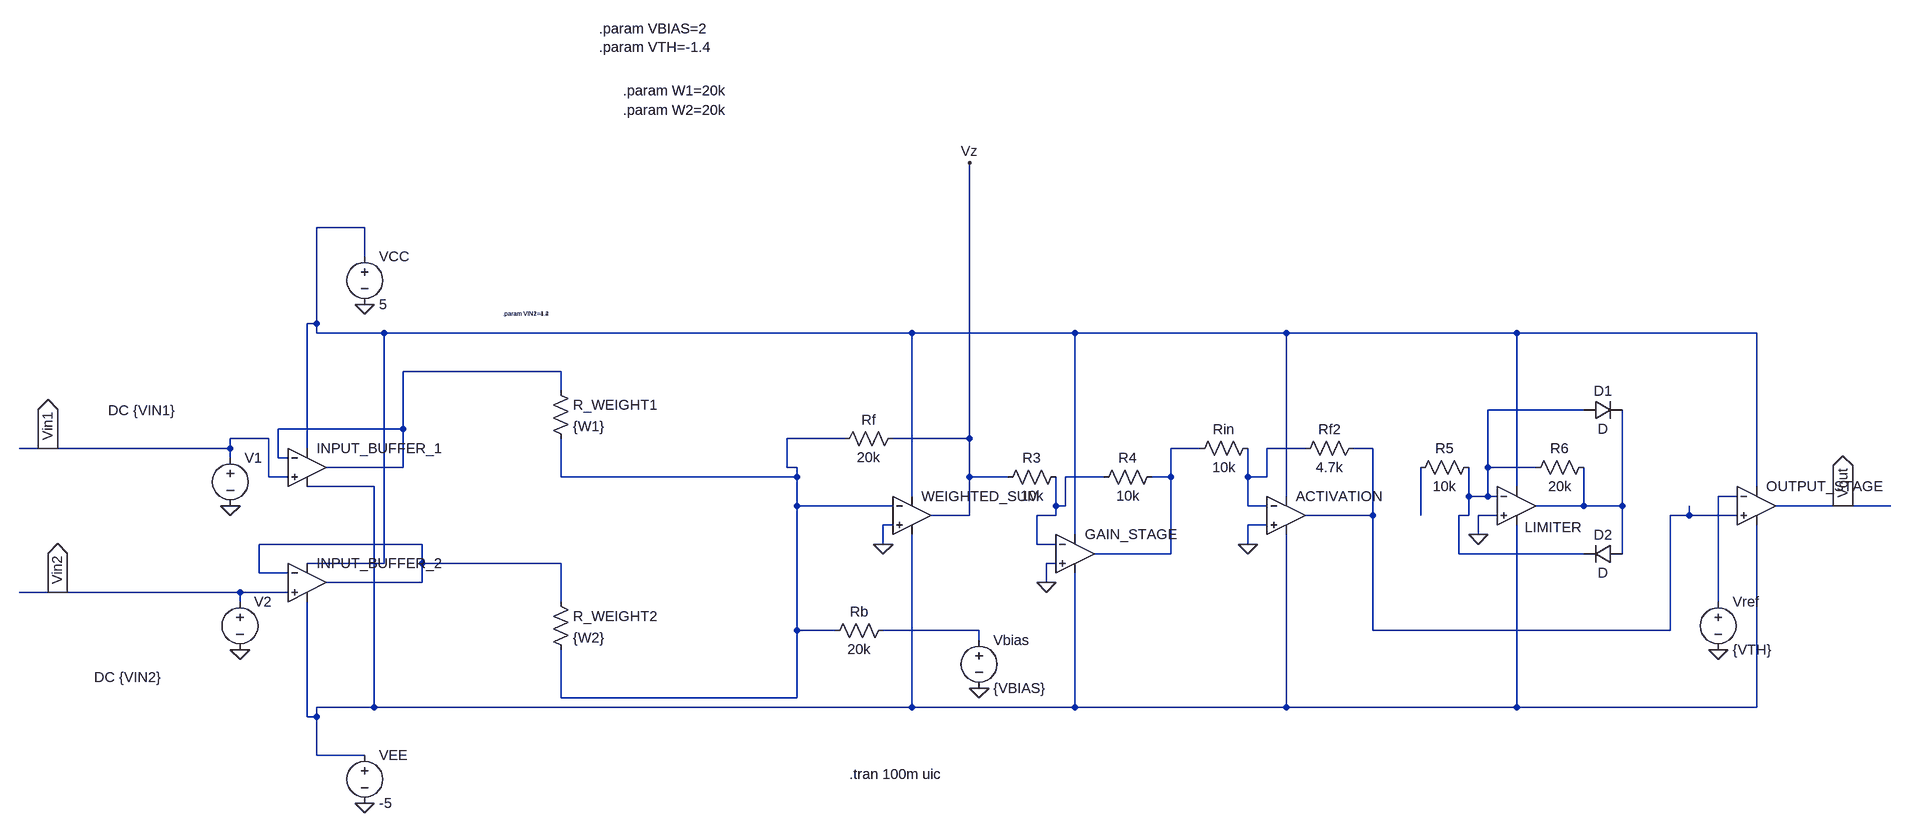
[diagram p0: schematic sim_00179.asc]
sim_00179.asc, the LTspice schematic file:
Version 4
SHEET 1 3976 980
WIRE -448 -112 -528 -112
WIRE -448 -64 -448 -112
WIRE -528 48 -528 -112
WIRE -528 48 -544 48
WIRE -528 64 -528 48
WIRE -416 64 -528 64
WIRE 816 64 -416 64
WIRE 1088 64 816 64
WIRE 1440 64 1088 64
WIRE 1824 64 1440 64
WIRE 2224 64 1824 64
WIRE 64 128 -384 128
WIRE 64 160 64 128
WIRE 1936 192 1776 192
WIRE -384 224 -384 128
WIRE -384 224 -592 224
WIRE -608 240 -672 240
WIRE 704 240 608 240
WIRE 912 240 912 -240
WIRE 912 240 784 240
WIRE -976 256 -1024 256
WIRE -672 256 -672 240
WIRE -672 256 -976 256
WIRE -544 256 -544 48
WIRE 1296 256 1248 256
WIRE 1472 256 1408 256
WIRE 1584 256 1552 256
WIRE -672 272 -672 256
WIRE -592 272 -592 224
WIRE -576 272 -592 272
WIRE -384 288 -384 224
WIRE -384 288 -512 288
WIRE 608 288 608 240
WIRE 624 288 608 288
WIRE 1776 288 1776 192
WIRE 1856 288 1776 288
WIRE -608 304 -608 240
WIRE -576 304 -608 304
WIRE 64 304 64 240
WIRE 624 304 624 288
WIRE 624 304 64 304
WIRE 912 304 912 240
WIRE 976 304 912 304
WIRE 1136 304 1072 304
WIRE 1248 304 1248 256
WIRE 1248 304 1216 304
WIRE 1376 304 1376 256
WIRE 1408 304 1408 256
WIRE 1408 304 1376 304
WIRE -432 320 -544 320
WIRE 1824 320 1824 64
WIRE 2224 320 2224 64
WIRE 816 336 816 64
WIRE 1440 336 1440 64
WIRE 1744 336 1744 288
WIRE 1776 336 1776 288
WIRE 1776 336 1744 336
WIRE 1792 336 1776 336
WIRE 2192 336 2160 336
WIRE 624 352 624 304
WIRE 784 352 624 352
WIRE 1056 352 1056 304
WIRE 1072 352 1072 304
WIRE 1072 352 1056 352
WIRE 1376 352 1376 304
WIRE 1408 352 1376 352
WIRE 1936 352 1936 288
WIRE 1936 352 1856 352
WIRE 2000 352 2000 192
WIRE 2000 352 1936 352
WIRE 2368 352 2256 352
WIRE 2448 352 2368 352
WIRE 912 368 912 304
WIRE 912 368 848 368
WIRE 1056 368 1056 352
WIRE 1056 368 1024 368
WIRE 1584 368 1584 256
WIRE 1584 368 1472 368
WIRE 1664 368 1664 288
WIRE 1744 368 1744 336
WIRE 1744 368 1728 368
WIRE 1792 368 1760 368
WIRE 2112 368 2112 352
WIRE 2112 368 2080 368
WIRE 2192 368 2112 368
WIRE 784 384 768 384
WIRE 1408 384 1376 384
WIRE 1088 400 1088 64
WIRE 1760 400 1760 368
WIRE -352 416 -624 416
WIRE 768 416 768 384
WIRE 1024 416 1024 368
WIRE 1056 416 1024 416
WIRE 1376 416 1376 384
WIRE 1248 432 1248 304
WIRE 1248 432 1120 432
WIRE 1728 432 1728 368
WIRE 1936 432 1728 432
WIRE 2000 432 2000 352
WIRE -416 448 -416 64
WIRE -416 448 -544 448
WIRE -352 448 -352 416
WIRE 64 448 -352 448
WIRE 1056 448 1040 448
WIRE -624 464 -624 416
WIRE -576 464 -624 464
WIRE -352 480 -352 448
WIRE -352 480 -512 480
WIRE 1040 480 1040 448
WIRE -960 496 -1024 496
WIRE -656 496 -960 496
WIRE -576 496 -656 496
WIRE -656 512 -656 496
WIRE 64 512 64 448
WIRE 2160 512 2160 336
WIRE 624 560 624 352
WIRE 688 560 624 560
WIRE 928 560 768 560
WIRE 1584 560 1584 368
WIRE 2080 560 2080 368
WIRE 2080 560 1584 560
WIRE 928 576 928 560
WIRE 64 672 64 592
WIRE 624 672 624 560
WIRE 624 672 64 672
WIRE -432 688 -432 320
WIRE -432 688 -528 688
WIRE 816 688 816 400
WIRE 816 688 -432 688
WIRE 1088 688 1088 464
WIRE 1088 688 816 688
WIRE 1440 688 1440 400
WIRE 1440 688 1088 688
WIRE 1824 688 1824 384
WIRE 1824 688 1440 688
WIRE 2224 688 2224 384
WIRE 2224 688 1824 688
WIRE -544 704 -544 512
WIRE -528 704 -528 688
WIRE -528 704 -544 704
WIRE -528 768 -528 704
WIRE -448 768 -528 768
FLAG -448 16 0
FLAG -448 848 0
FLAG -656 592 0
FLAG -672 352 0
FLAG 768 416 0
FLAG 928 656 0
FLAG 1040 480 0
FLAG -976 256 Vin1
IOPIN -976 256 Out
FLAG -960 496 Vin2
IOPIN -960 496 Out
FLAG 912 -240 Vz
FLAG 1376 416 0
FLAG 1760 400 0
FLAG 2160 592 0
FLAG 2368 352 Vout
IOPIN 2368 352 Out
SYMBOL voltage -448 -80 R0
WINDOW 123 0 0 Left 0
WINDOW 39 0 0 Left 0
SYMATTR InstName VCC
SYMATTR Value 5
SYMBOL voltage -448 752 R0
WINDOW 123 0 0 Left 0
WINDOW 39 0 0 Left 0
SYMATTR InstName VEE
SYMATTR Value -5
SYMBOL voltage -672 256 R0
WINDOW 3 -204 -63 Left 2
WINDOW 123 0 0 Left 0
WINDOW 39 0 0 Left 0
SYMATTR Value DC {VIN1}
SYMATTR InstName V1
SYMBOL voltage -656 496 R0
WINDOW 3 -243 142 Left 2
WINDOW 123 0 0 Left 0
WINDOW 39 0 0 Left 0
SYMATTR Value DC {VIN2}
SYMATTR InstName V2
SYMBOL OpAmps\\UniversalOpAmp2 -544 288 R0
SYMATTR InstName INPUT_BUFFER_1
SYMBOL OpAmps\\UniversalOpAmp2 -544 480 R0
SYMATTR InstName INPUT_BUFFER_2
SYMBOL OpAmps\\UniversalOpAmp2 816 368 R0
SYMATTR InstName WEIGHTED_SUM
SYMBOL res 800 224 R90
WINDOW 0 0 56 VBottom 2
WINDOW 3 32 56 VTop 2
SYMATTR InstName Rf
SYMATTR Value 20k
SYMBOL voltage 928 560 R0
WINDOW 123 0 0 Left 0
WINDOW 39 0 0 Left 0
SYMATTR InstName Vbias
SYMATTR Value {VBIAS}
SYMBOL res 784 544 R90
WINDOW 0 0 56 VBottom 2
WINDOW 3 32 56 VTop 2
SYMATTR InstName Rb
SYMATTR Value 20k
SYMBOL OpAmps\\UniversalOpAmp2 1088 432 R0
SYMATTR InstName GAIN_STAGE
SYMBOL res 1072 288 R90
WINDOW 0 0 56 VBottom 2
WINDOW 3 32 56 VTop 2
SYMATTR InstName R3
SYMATTR Value 10k
SYMBOL res 1232 288 R90
WINDOW 0 0 56 VBottom 2
WINDOW 3 32 56 VTop 2
SYMATTR InstName R4
SYMATTR Value 10k
SYMBOL OpAmps\\UniversalOpAmp2 1440 368 R0
SYMATTR InstName ACTIVATION
SYMBOL res 1392 240 R90
WINDOW 0 0 56 VBottom 2
WINDOW 3 32 56 VTop 2
SYMATTR InstName Rin
SYMATTR Value 10k
SYMBOL res 1568 240 R90
WINDOW 0 0 56 VBottom 2
WINDOW 3 32 56 VTop 2
SYMATTR InstName Rf2
SYMATTR Value 4.7k
SYMBOL OpAmps\\UniversalOpAmp2 1824 352 R0
WINDOW 0 14 36 Left 2
SYMATTR InstName LIMITER
SYMBOL diode 1936 208 R270
WINDOW 0 32 32 VTop 2
WINDOW 3 0 32 VBottom 2
SYMATTR InstName D1
SYMBOL diode 2000 416 R90
WINDOW 0 0 32 VBottom 2
WINDOW 3 32 32 VTop 2
SYMATTR InstName D2
SYMBOL res 1760 272 R90
WINDOW 0 0 56 VBottom 2
WINDOW 3 32 56 VTop 2
SYMATTR InstName R5
SYMATTR Value 10k
SYMBOL res 1952 272 R90
WINDOW 0 0 56 VBottom 2
WINDOW 3 32 56 VTop 2
SYMATTR InstName R6
SYMATTR Value 20k
SYMBOL OpAmps\\UniversalOpAmp2 2224 352 R0
SYMATTR InstName OUTPUT_STAGE
SYMBOL voltage 2160 496 R0
WINDOW 123 0 0 Left 0
WINDOW 39 0 0 Left 0
SYMATTR InstName Vref
SYMATTR Value {VTH}
SYMBOL res 48 144 R0
SYMATTR InstName R_WEIGHT1
SYMATTR Value {W1}
SYMBOL res 48 496 R0
SYMATTR InstName R_WEIGHT2
SYMATTR Value {W2}
TEXT 712 800 Left 2 !.tran 100m uic
TEXT 168 -360 Left 2 !.param W1=20k
TEXT 168 -328 Left 2 !.param W2=20k
TEXT 128 -464 Left 2 !.param VBIAS=2\n.param VTH=-1.4
TEXT -32 32 Left 0 !.param VIN1=1.2

TEXT -32 32 Left 0 !.param VIN2=4.4

The netlist it stands for:
* sim_00179.asc
VCC N001 0 5
VEE N009 0 -5
V1 Vin1 0 DC {VIN1}
V2 Vin2 0 DC {VIN2}
XINPUT_BUFFER_1 Vin1 N002 N001 N009 N002 level2 Avol=1Meg GBW=10Meg Slew=10Meg Ilimit=25m Rail=0 Vos=0 En=0 Enk=0 In=0 Ink=0 Rin=500Meg  ; pins In+ In- V+ V- OUT
XINPUT_BUFFER_2 Vin2 N013 N001 N009 N013 level2 Avol=1Meg GBW=10Meg Slew=10Meg Ilimit=25m Rail=0 Vos=0 En=0 Enk=0 In=0 Ink=0 Rin=500Meg  ; pins In+ In- V+ V- OUT
XWEIGHTED_SUM 0 N004 N001 N009 Vz level2 Avol=1Meg GBW=10Meg Slew=10Meg Ilimit=25m Rail=0 Vos=0 En=0 Enk=0 In=0 Ink=0 Rin=500Meg  ; pins In+ In- V+ V- OUT
Rf Vz N004 20k
Vbias N014 0 {VBIAS}
Rb N014 N004 20k
XGAIN_STAGE 0 N008 N001 N009 N005 level2 Avol=1Meg GBW=10Meg Slew=10Meg Ilimit=25m Rail=0 Vos=0 En=0 Enk=0 In=0 Ink=0 Rin=500Meg  ; pins In+ In- V+ V- OUT
R3 N008 Vz 10k
R4 N005 N008 10k
XACTIVATION 0 N006 N001 N009 N007 level2 Avol=1Meg GBW=10Meg Slew=10Meg Ilimit=25m Rail=0 Vos=0 En=0 Enk=0 In=0 Ink=0 Rin=500Meg  ; pins In+ In- V+ V- OUT
Rin N006 N005 10k
Rf2 N007 N006 4.7k
XLIMITER 0 N003 N001 N009 N011 level2 Avol=1Meg GBW=10Meg Slew=10Meg Ilimit=25m Rail=0 Vos=0 En=0 Enk=0 In=0 Ink=0 Rin=500Meg  ; pins In+ In- V+ V- OUT
D1 N003 N011 D
D2 N011 N003 D
R5 N003 N012 10k
R6 N011 N003 20k
XOUTPUT_STAGE N007 N010 N001 N009 Vout level2 Avol=1Meg GBW=10Meg Slew=10Meg Ilimit=25m Rail=0 Vos=0 En=0 Enk=0 In=0 Ink=0 Rin=500Meg  ; pins In+ In- V+ V- OUT
Vref N010 0 {VTH}
R_WEIGHT1 N002 N004 {W1}
R_WEIGHT2 N013 N004 {W2}
.model D D
.lib standard.dio
.tran 100m uic
.param W1=20k
.param W2=20k
.param VBIAS=2
.param VTH=-1.4
.param VIN1=1.2
.param VIN2=4.4
.lib UniversalOpAmp2.lib
.backanno
.end

* Results of the author's LTspice run, read from the files saved beside the schematic
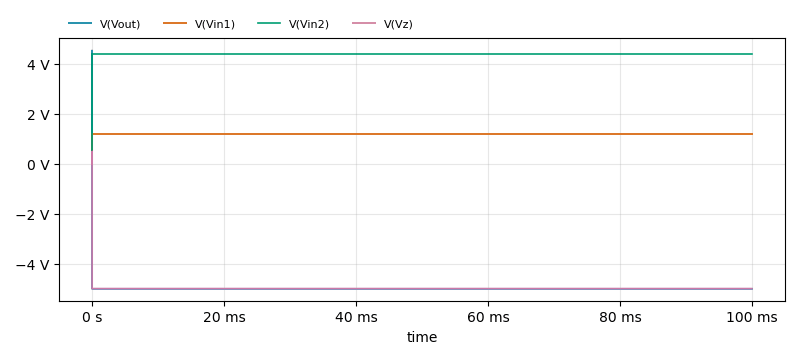
[diagram p1: Transient Analysis of sim_00179.asc, plotted from the saved traces]
* Transient Analysis, 1 run:
*   V(Vout): min -5 V, max 4.534 V, average -5 V, rms 5 V, last -5 V
*   V(Vin1): min 0 V, max 1.2 V, average 1.2 V, rms 1.2 V, last 1.2 V
*   V(Vin2): min 0 V, max 4.4 V, average 4.4 V, rms 4.4 V, last 4.4 V
*   V(Vz): min -4.992 V, max 495.4 mV, average -4.992 V, rms 4.992 V, last -4.992 V